# Altium schematic sheet Current Shunts.SchDoc
size 406 x 304 mm; SheetNumber: 5; SheetTotal: 14
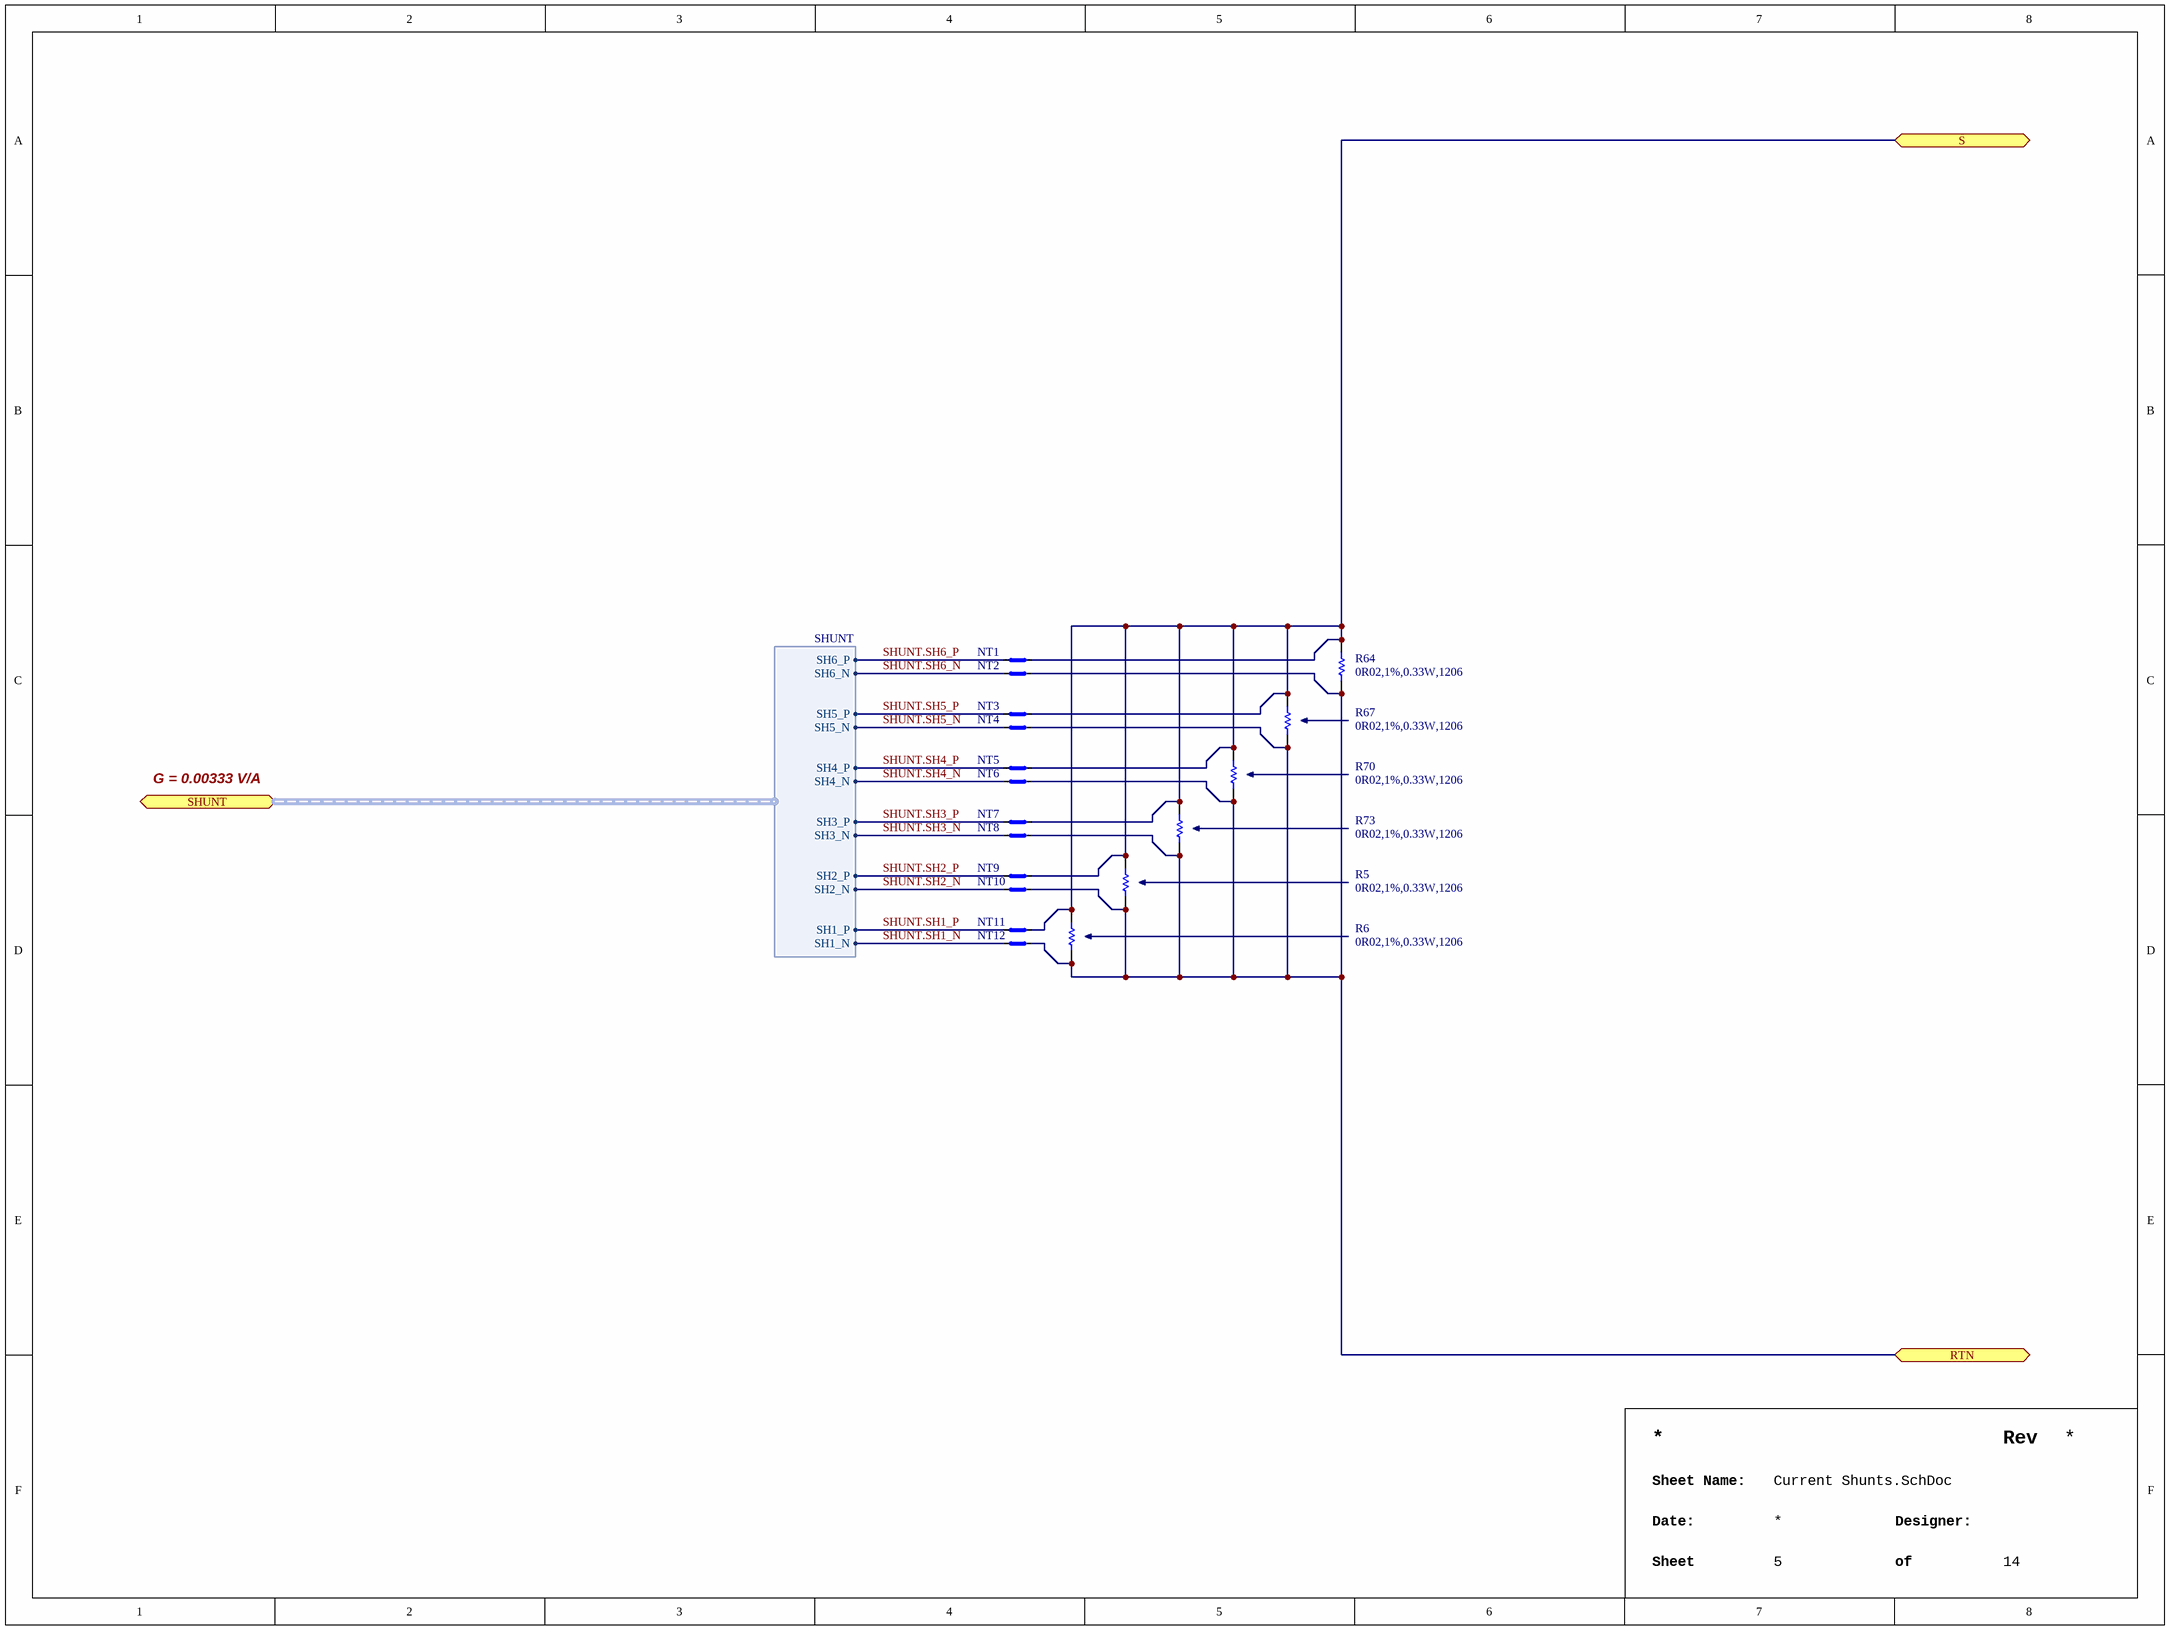
[diagram p0: Current Shunts.SchDoc]

## Parts
NT1  NETTIE  [NETTIE_150X300UM]  (value not drawn)  (net tie, no BOM)
NT2  NETTIE  [NETTIE_150X300UM]  (value not drawn)  (net tie, no BOM)
NT3  NETTIE  [NETTIE_150X300UM]  (value not drawn)  (net tie, no BOM)
NT4  NETTIE  [NETTIE_150X300UM]  (value not drawn)  (net tie, no BOM)
NT5  NETTIE  [NETTIE_150X300UM]  (value not drawn)  (net tie, no BOM)
NT6  NETTIE  [NETTIE_150X300UM]  (value not drawn)  (net tie, no BOM)
NT7  NETTIE  [NETTIE_150X300UM]  (value not drawn)  (net tie, no BOM)
NT8  NETTIE  [NETTIE_150X300UM]  (value not drawn)  (net tie, no BOM)
NT9  NETTIE  [NETTIE_150X300UM]  (value not drawn)  (net tie, no BOM)
NT10  NETTIE  [NETTIE_150X300UM]  (value not drawn)  (net tie, no BOM)
NT11  NETTIE  [NETTIE_150X300UM]  (value not drawn)  (net tie, no BOM)
NT12  NETTIE  [NETTIE_150X300UM]  (value not drawn)  (net tie, no BOM)
R5  0R02,1%,0.33W,1206  [RESC3216X06N]
R6  0R02,1%,0.33W,1206  [RESC3216X06N]
R64  0R02,1%,0.33W,1206  [RESC3216X06N]
R67  0R02,1%,0.33W,1206  [RESC3216X06N]
R70  0R02,1%,0.33W,1206  [RESC3216X06N]
R73  0R02,1%,0.33W,1206  [RESC3216X06N]

## Ports
RTN (bidir), S (bidir), SHUNT (bidir, harness SHUNT)

## Harnesses
SHUNT: SH1_P, SH1_N, SH2_P, SH2_N, SH3_P, SH3_N, SH4_P, SH4_N, SH5_P, SH5_N, SH6_P, SH6_N

## Nets
RTN: NT2.2 NT4.2 NT6.2 NT8.2 NT10.2 NT12.2 R5.1 R6.1 R64.1 R67.1 R70.1 R73.1 ; port RTN
S: NT1.2 NT3.2 NT5.2 NT7.2 NT9.2 NT11.2 R5.2 R6.2 R64.2 R67.2 R70.2 R73.2 ; port S
SHUNT.SH1_N: NT12.1 ; port SHUNT.SH1_N
SHUNT.SH1_P: NT11.1 ; port SHUNT.SH1_P
SHUNT.SH2_N: NT10.1 ; port SHUNT.SH2_N
SHUNT.SH2_P: NT9.1 ; port SHUNT.SH2_P
SHUNT.SH3_N: NT8.1 ; port SHUNT.SH3_N
SHUNT.SH3_P: NT7.1 ; port SHUNT.SH3_P
SHUNT.SH4_N: NT6.1 ; port SHUNT.SH4_N
SHUNT.SH4_P: NT5.1 ; port SHUNT.SH4_P
SHUNT.SH5_N: NT4.1 ; port SHUNT.SH5_N
SHUNT.SH5_P: NT3.1 ; port SHUNT.SH5_P
SHUNT.SH6_N: NT2.1 ; port SHUNT.SH6_N
SHUNT.SH6_P: NT1.1 ; port SHUNT.SH6_P

## Notes on the sheet
- G = 0.00333 V/A
- Rev
- Sheet Name:
- Date:
- Sheet
- Designer:
- of

## Library data of the parts
NT1-NT12 = NETTIE,150X300UM: Net Tie; Part Name: NETTIE,150X300UM; CreatedBy: Judd Foster; HelpURL: N/A; Manufacturer 1: N/A; Manufacturer 1 Part Number: N/A; Vendor 1: N/A; Vendor 1 Part Number: N/A
R5 R6 R64 R67 R70 R73 = RES,0R02,1%,0.33W,1206: 333mW 20mÎ© 200V Â±1000ppm/â„ƒ Thick Film Resistor Â±1% 1206 Chip Resistor - Surface Mount ROHS; Manufacturer 1: UNI-ROYAL; Manufacturer 1 Part Number: 1206W3F200MT5E; Vendor 1 Part Number: C2765435; Vendor 1: LCSC; Value: 0.02; Part Name: RES,0R02,1%,0.33W,1206; CreatedBy: Judd Foster; HelpURL: https://www.lcsc.com/datasheet/C2765435.pdf